# EAGLE design midicontrol_v6 (EAGLE 9.4.0)
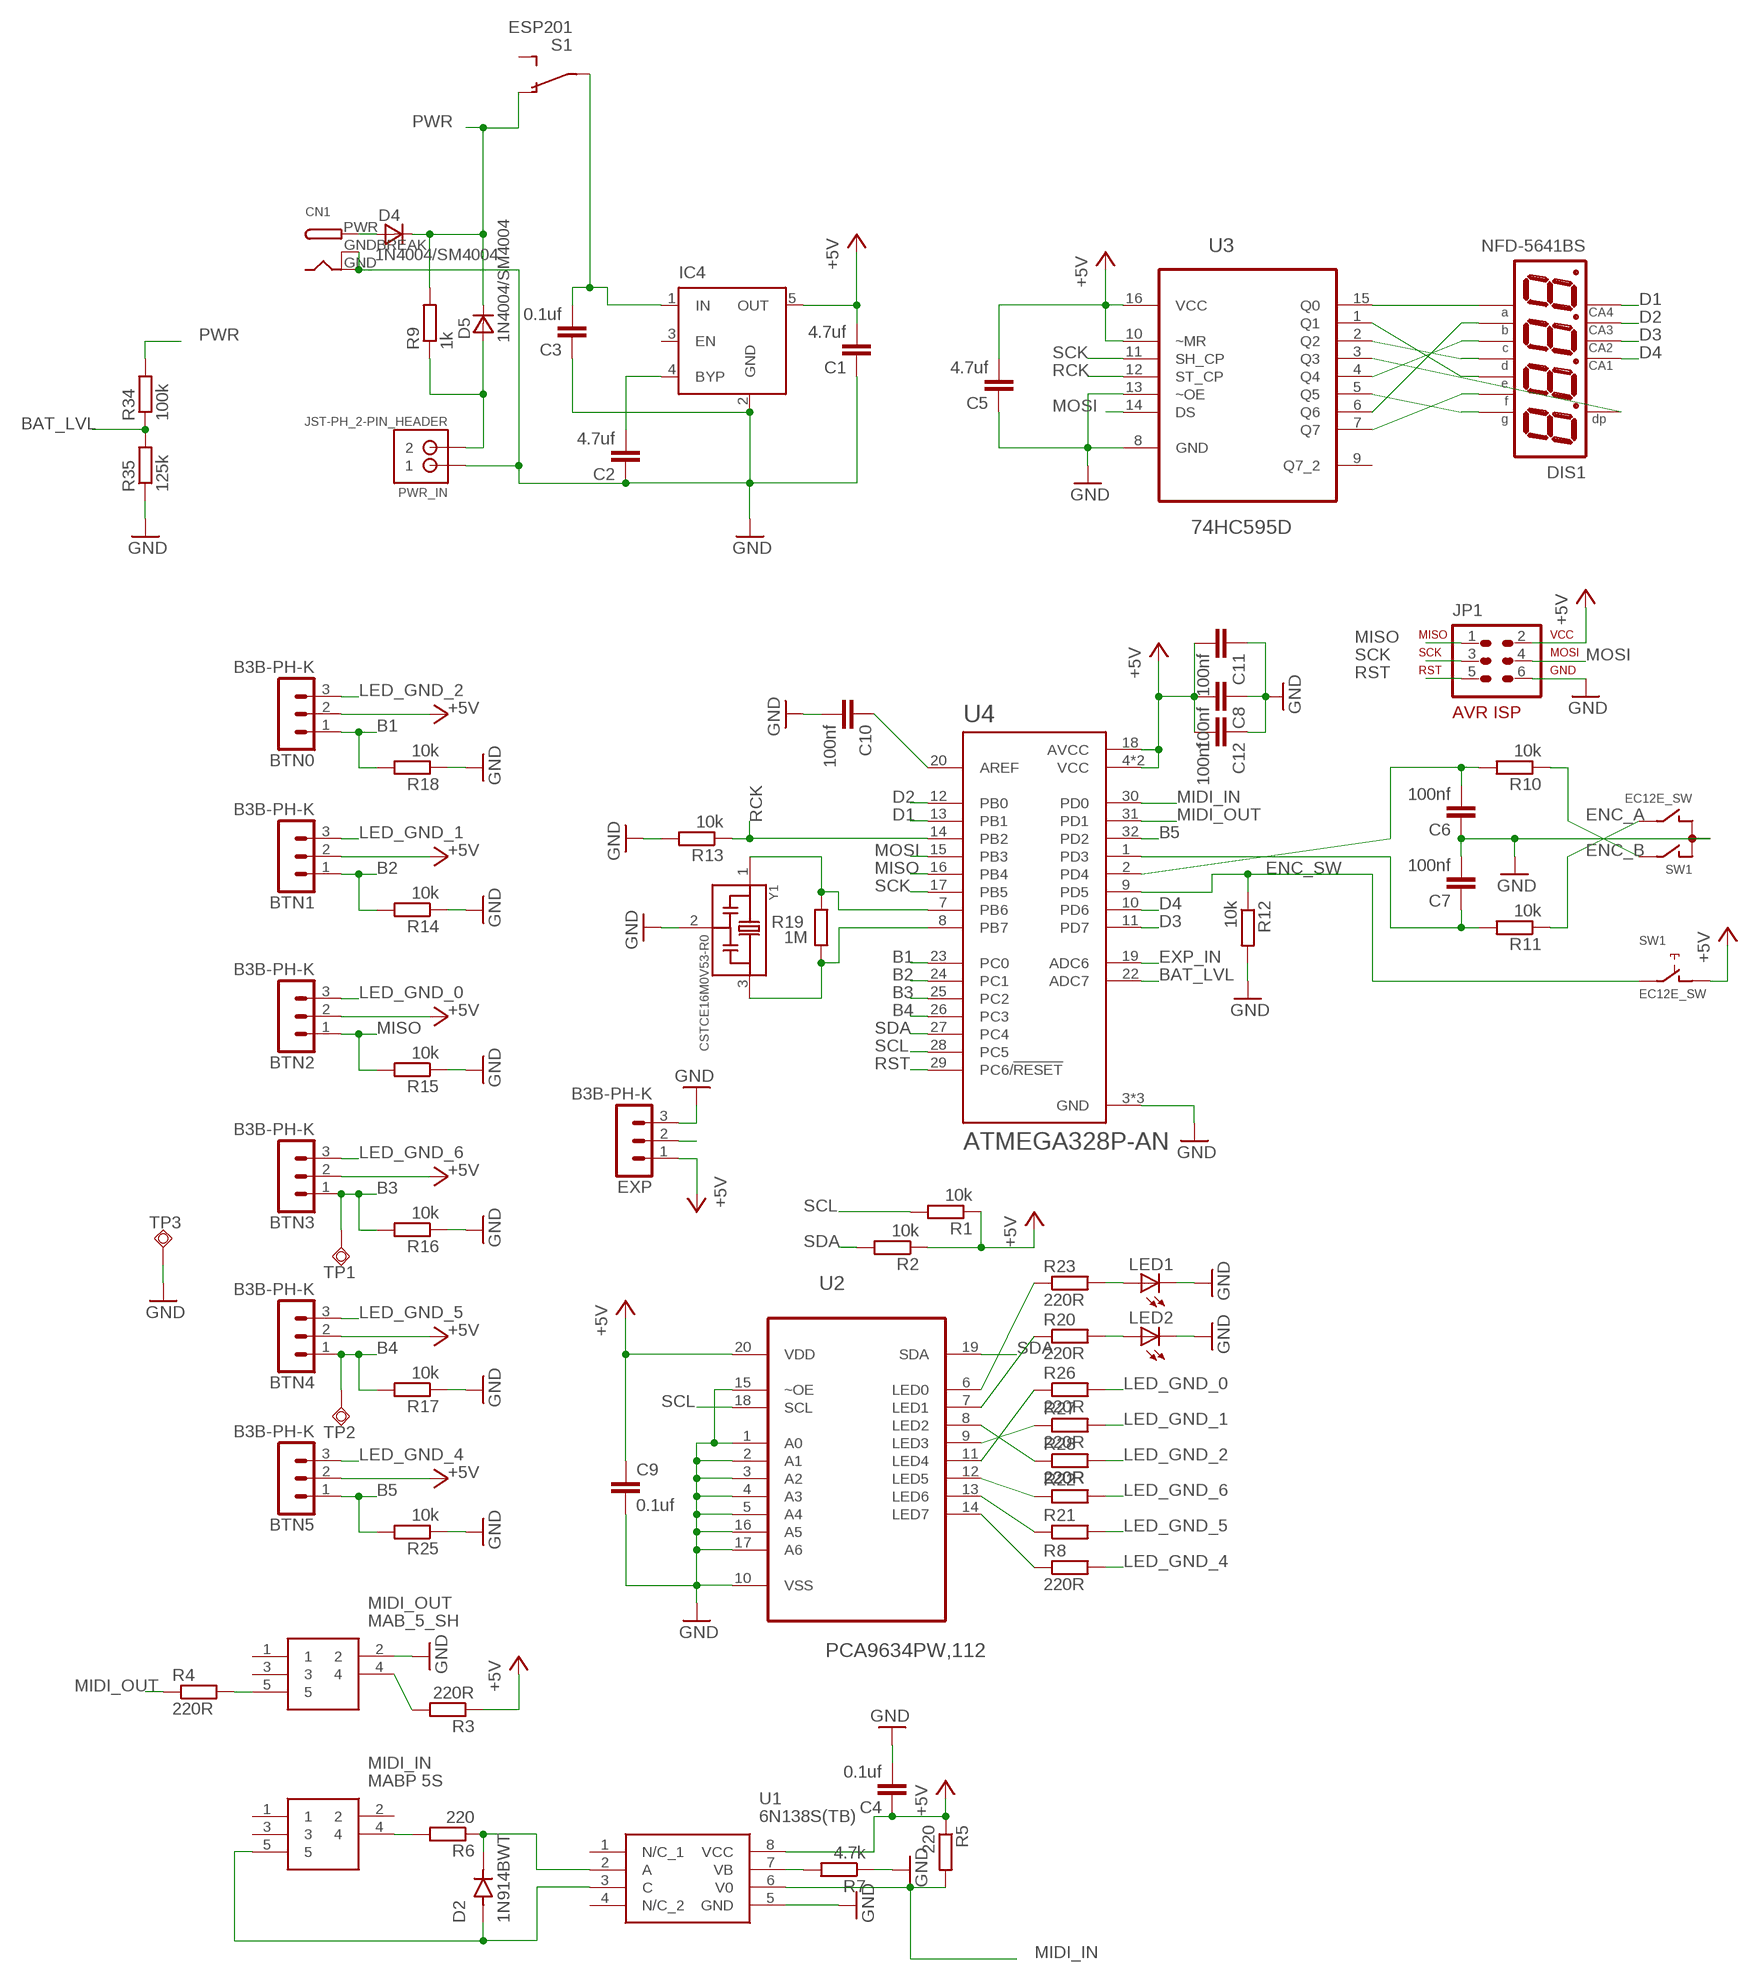
[diagram p0: schematic, sheet 1]

## Parts
BTN0  B3B-PH-K  [B3B-PH-K]
BTN1  B3B-PH-K  [B3B-PH-K]
BTN2  B3B-PH-K  [B3B-PH-K]
BTN3  B3B-PH-K  [B3B-PH-K]
BTN4  B3B-PH-K  [B3B-PH-K]
BTN5  B3B-PH-K  [B3B-PH-K]
C1  4.7uf  C-EUC1206  [C1206]
C2  4.7uf  C-EUC1206  [C1206]
C3  0.1uf  C-EUC0603  [C0603]
C4  0.1uf  C-EUC0603  [C0603]
C5  4.7uf  C-EUC0603  [C0603]
C6  100nf  C-EUC0603  [C0603]
C7  100nf  C-EUC0603  [C0603]
C8  100nf  C-EUC1206  [C1206]
C9  0.1uf  C-EUC0603  [C0603]
C10  100nf  C-EUC0603  [C0603]
C11  100nf  C-EUC0603  [C0603]
C12  100nf  C-EUC0603  [C0603]
CN1  DCBARRELPTH  [DCJACK_2MM_PTH]
D2  1N914BWT  [SODFL1608X70N]
D4  1N4004/SM4004  SM4004  [MELF-MLL41]
D5  1N4004/SM4004  SM4004  [MELF-MLL41]
DIS1  NFD-5641BS  [NFD-5641]
EXP  B3B-PH-K  [B3B-PH-K]
IC4  MIC5219XX  [SOT23-5]
JP1  AVR-ISP-6HORZ  [AVR-ISP-6R]
LED1  LED3MM  [LED3MM]
LED2  LED3MM  [LED3MM]
MIDI_IN  MABP 5S  MAB_5_SH  [MAB-5-SH]
MIDI_OUT  MAB_5_SH  [MAB-5-SH]
PWR_IN  JST-PH_2-PIN_HEADER  [JST_B2B-PH_HEADER]
R1  10k  R-EU_R0603  [R0603]
R2  10k  R-EU_R0603  [R0603]
R3  220R  R-EU_R0603  [R0603]
R4  220R  R-EU_R0603  [R0603]
R5  220  R-EU_R0603  [R0603]
R6  220  R-EU_R0603  [R0603]
R7  4.7k  R-EU_R0603  [R0603]
R8  220R  R-EU_R0603  [R0603]
R9  1k  R-EU_R0603  [R0603]
R10  10k  R-EU_R0603  [R0603]
R11  10k  R-EU_R0603  [R0603]
R12  10k  R-EU_R0603  [R0603]
R13  10k  R-EU_R0603  [R0603]
R14  10k  R-EU_R0603  [R0603]
R15  10k  R-EU_R0603  [R0603]
R16  10k  R-EU_R0603  [R0603]
R17  10k  R-EU_R0603  [R0603]
R18  10k  R-EU_R0603  [R0603]
R19  1M  R-EU_R0603  [R0603-ROUND]
R20  220R  R-EU_R0603  [R0603]
R21  220R  R-EU_R0603  [R0603]
R22  220R  R-EU_R0603  [R0603]
R23  220R  R-EU_R0603  [R0603]
R25  10k  R-EU_R0603  [R0603]
R26  220R  R-EU_R0603  [R0603]
R27  220R  R-EU_R0603  [R0603]
R28  220R  R-EU_R0603  [R0603]
R34  100k  R-EU_R0603  [R0603]
R35  125k  R-EU_R0603  [R0603]
S1  ESP201  [ESP201]
SW1  EC12E_SW  [ALPS_EC12E_SW]
TP1  TPSQTP18R  [TP18R]
TP2  TPSQTP18R  [TP18R]
TP3  TPSQTP18R  [TP18R]
U1  6N138S(TB)  [SOP254P1030X460-8N]
U2  PCA9634PW,112  [SOP65P640X110-20N]
U3  74HC595D  [SOIC127P600X175-16N]
U4  ATMEGA328P-AN  [QFP80P900X900X120-32N]
Y1  CSTCE16M0V53-R0  [OSC_CSTCE16M0V53-R0]

## Nets
+5V: BTN0.2 BTN1.2 BTN2.2 BTN3.2 BTN4.2 BTN5.2 C1.2 C4.1 C5.2 C8.2 C9.1 C11.2 C12.2 EXP.1 IC4.5(OUT) JP1.2 R1.1 R2.1 R3.1 R5.1 SW1.D U1.8(VCC) U2.20(VDD) U3.10(~MR) U3.16(VCC) U4.4(VCC) U4.6(VCC) U4.18(AVCC)
B1: BTN0.1 R18.2 U4.23(PC0)
B2: BTN1.1 R14.2 U4.24(PC1)
B3: BTN3.1 R16.2 TP1.TP U4.25(PC2)
B4: BTN4.1 R17.2 TP2.TP U4.26(PC3)
B5: BTN5.1 R25.2 U4.32(PD2)
BAT_LVL: R34.1 R35.2 U4.22(ADC7)
D1: DIS1.P$6 U4.13(PB1)
D2: DIS1.P$8 U4.12(PB0)
D3: DIS1.P$9 U4.11(PD7)
D4: DIS1.P$12 U4.10(PD6)
ENC_A: R10.1 SW1.A
ENC_B: R11.1 SW1.B
ENC_SW: R12.1 SW1.E U4.9(PD5)
EXP_IN: EXP.2 U4.19(ADC6)
GND: C1.1 C2.1 C3.1 C4.2 C5.1 C6.1 C7.2 C8.1 C9.2 C10.2 C11.1 C12.1 CN1.GND CN1.GNDBREAK EXP.3 IC4.2(GND) JP1.6 LED1.K(C) LED2.K(C) MIDI_OUT.2 PWR_IN.P1 R7.1 R12.2 R13.2 R14.1 R15.1 R16.1 R17.1 R18.1 R25.1 R35.1 SW1.C TP3.TP U1.5(GND) U2.1(A0) U2.2(A1) U2.3(A2) U2.4(A3) U2.5(A4) U2.10(VSS) U2.15(~OE) U2.16(A5) U2.17(A6) U3.8(GND) U3.13(~OE) U4.3(GND) U4.5(GND) U4.21(GND) Y1.2
LED_GND_0: BTN2.3 R26.2
LED_GND_1: BTN1.3 R27.2
LED_GND_2: BTN0.3 R28.2
LED_GND_4: BTN5.3 R8.2
LED_GND_5: BTN4.3 R21.2
LED_GND_6: BTN3.3 R22.2
MIDI_IN: R5.2 U1.6(V0) U4.30(PD0)
MIDI_OUT: R4.1 U4.31(PD1)
MISO: BTN2.1 JP1.1 R15.2 U4.16(PB4)
MOSI: JP1.4 U3.14(DS) U4.15(PB3)
N$1: DIS1.P$11 U3.15(Q0)
N$2: DIS1.P$7 U3.6(Q6)
N$3: DIS1.P$4 U3.4(Q4)
N$4: DIS1.P$2 U3.2(Q2)
N$5: DIS1.P$1 U3.1(Q1)
N$6: DIS1.P$10 U3.7(Q7)
N$7: DIS1.P$5 U3.5(Q5)
N$8: DIS1.P$3 U3.3(Q3)
N$9: MIDI_OUT.4 R3.2
N$10: MIDI_OUT.5 R4.2
N$11: D2.A MIDI_IN.5 U1.3(C)
N$12: D2.C(K) R6.1 U1.2(A)
N$13: MIDI_IN.4 R6.2
N$14: R7.2 U1.7(VB)
N$15: C6.2 R10.2 U4.2(PD4)
N$16: R19.1 U4.8(PB7) Y1.3
N$17: C7.1 R11.2 U4.1(PD3)
N$18: D5.A PWR_IN.P2 R9.1
N$19: R19.2 U4.7(PB6) Y1.1
N$20: C2.2 IC4.4(BYP)
N$21: C10.1 U4.20(AREF)
N$22: LED2.A R20.2
N$23: R8.1 U2.14(LED7)
N$24: R21.1 U2.13(LED6)
N$25: CN1.PWR D4.A
N$26: C3.2 IC4.1(IN) S1.P$1(P)
N$27: R22.1 U2.12(LED5)
N$28: R26.1 U2.11(LED4)
N$29: R27.1 U2.9(LED3)
N$30: R28.1 U2.8(LED2)
N$31: R20.1 U2.7(LED1)
N$32: R23.1 U2.6(LED0)
N$33: LED1.A R23.2
PWR: D4.C D5.C R9.2 R34.2 S1.P$3(O)
RCK: R13.1 U3.12(ST_CP) U4.14(PB2)
RST: JP1.5 U4.29(PC6/!RESET)
SCK: JP1.3 U3.11(SH_CP) U4.17(PB5)
SCL: R1.2 U2.18(SCL) U4.28(PC5)
SDA: R2.2 U2.19(SDA) U4.27(PC4)
Unconnected: IC4.3(EN) MIDI_IN.1 MIDI_IN.2 MIDI_IN.3 MIDI_OUT.1 MIDI_OUT.3 S1.P$2(S) SW1.GND1(G) SW1.GND2(G) U1.1(N/C_1) U1.4(N/C_2) U3.9(Q7_2)

## Library data of the parts
BTN0 BTN1-BTN5 EXP = con-jst-ph:B3B-PH-K: HEADER
C1-C12 = rcl:C-EU: CAPACITOR, European symbol; SPICEPREFIX: C
CN1 = adafruit:DCBARREL: 2.0mm DC Barrel Jack DCJACK_2MM_PTH - Through Hole Jack (4UConnector: 05537)
D2 = 1N914BWT:1N914BWT: 1N914B Series 75 V 300 mA Surface Mount Small Signal Diode - SOD-523F; AVAILABILITY: Unavailable; DESCRIPTION: 1N914B Series 75 V 300 mA Surface Mount Small Signal Diode - SOD-523F; MF: ON Semiconductor; MP: 1N914BWT; PACKAGE: SOD-523F ON Semiconductor; PRICE: None
D4 D5 = _mod_diode:SM400*: SM4001 .. SM4007 General Purpose Rectifier, 1 A SMD-Version of 1N4001 .. 1N4007 Case: MELF-MLL41 = DO 213 AB Author: Dipl.-Ing. FH Rainer Bayer HHN Hochschule Heilbronn, rainer.bayer@hs-heilbronn.de Ingenieurbüro ing-rb, mail@ing-rb.de
DIS1 = display-misc:NFD-5641BS: Four Digit 0.56" CA Seven-Segment LED Display Futurlec part number: 7FR5641BS Created by RobG
IC4 = v-reg-micrel:MIC5219XX: VOLTAGE REGULATOR; OC_FARNELL: unknown; OC_NEWARK: unknown
JP1 = avr-7:AVR-ISP-6: AVR ISP-6 Serial Programming Header
LED1 LED2 = adafruit:LED: LED OSRAM: - CHIPLED LG R971, LG N971, LY N971, LG Q971, LY Q971, LO R971, LY R971 LH N974, LH R974 LS Q976, LO Q976, LY Q976 LO Q996 - Hyper CHIPLED LW Q18S LB Q993, LB Q99A, LB R99A - SideLED LS A670, LO A670, LY A670, LG A670, LP A670 LB A673, LV A673, LT A673, LW A673 LH A674 LY A675 LS A676, LA A676, LO A676, LY A676, LW A676 LS A679, LY A679, LG A679 - Hyper Micro SIDELED® LS Y876, LA Y876, LO Y876, LY Y876 LT Y87S - SmartLED LW L88C, LW L88S LB L89C, LB L89S, LG L890 LS L89K, LO L89K, LY L89K LS L896, LA L896, LO L896, LY L896 - TOPLED LS T670, LO T670, LY T670, LG T670, LP T670 LSG T670, LSP T670, LSY T670, LOP T670, LYG T670 LG T671, LOG T671, LSG T671 LB T673, LV T673, LT T673, LW T673 LH T674 LS T676, LA T676, LO T676, LY T676, LB T676, LH T676, LSB T676, LW T676 LB T67C, LV T67C, LT T67C, LS T67K, LO T67K, LY T67K, LW E67C LS E67B, LA E67B, LO E67B, LY E67B, LB E67C, LV E67C, LT E67C LW T67C LS T679, LY T679, LG T679 LS T770, LO T770, LY T770, LG T770, LP T770 LB T773, LV T773, LT T773, LW T773 LH T774 LS E675, LA E675, LY E675, LS T675 LS T776, LA T776, LO T776, LY T776, LB T776 LHGB T686 LT T68C, LB T68C - Hyper Mini TOPLED® LB M676 - Mini TOPLED Santana® LG M470 LS M47K, LO M47K, LY M47K Source: http://www.osram.convergy.de/
MIDI_IN MIDI_OUT = MAB_5_SH:MAB_5_SH: HIRSCHMANN - MAB 5 SH - SOCKET, DIN, PCB, 5PIN Source: Datasheet <http://www.farnell.com/datasheets/1599432.pdf>; DESCRIPTION: HIRSCHMANN - MAB 5 SH - SOCKET, DIN, PCB, 5PIN; HEIGHT: mm; MANUFACTURER_NAME: Hirschmann; MANUFACTURER_PART_NUMBER: MAB 5 SH
PWR_IN = srg:JST-PH_2-PIN_HEADER: 2-pin JST PH Shrouded Header, top entry P/N B2B-PH-K-S Mating connector PHR-2 Mating cable assembly: Sparkfun PRT-09914 <http://www.sparkfun.com/products/9914>
R1-R18 R20-R23 R25-R28 R34 R35 = rcl:R-EU_: RESISTOR, European symbol; SPICEPREFIX: R
R19 = SmartPrj:R-EU_: RESISTOR, European symbol
S1 = olli:ESP201: Switch ESP201 available at reichelt.de
SW1 = switch-alps:EC12E_SW: ALPS rotary Encoder EC12E series with switch; MPN: EC12E2424407; OC_FARNELL: 1520813; OC_NEWARK: 74M1068
TP1-TP3 = testpad:TPSQ: Test pad
U1 = 6N138S(TB):6N138S(TB): High Speed Optocouplers Low Input, High Gain DC Input Source: Datasheet <https://componentsearchengine.com/Datasheets/1/6N138S(TB).pdf>; DESCRIPTION: High Speed Optocouplers Low Input, High Gain DC Input; HEIGHT: 4.6mm; MANUFACTURER_NAME: Everlight; MANUFACTURER_PART_NUMBER: 6N138S(TB); MOUSER_PART_NUMBER: 638-6N138STB; MOUSER_PRICE-STOCK: https://www.mouser.com/Search/Refine.aspx?Keyword=638-6N138STB
U2 = PCA9634PW_112:PCA9634PW,112: 8-bit Fm+ I2C-bus LED driver; AVAILABILITY: Unavailable; DESCRIPTION: LED DRVR 16Segment 2.5V/3.3V/5V 20-Pin TSSOP Tube; MF: NXP USA; MP: PCA9634PW,112; PACKAGE: TSSOP-20 NXP Semiconductors; PRICE: None
U3 = 74HC595D:74HC595D: 8-bit serial-in parallel-out shift register; AVAILABILITY: Unavailable; DESCRIPTION: Shift Register Single 8-Bit Serial to Serial/Parallel 16-Pin SO; MF: Toshiba Semiconductor; MP: 74HC595D; PACKAGE: SO-16 NXP Semiconductors; PRICE: None
U4 = ATMEGA328P-AN:ATMEGA328P-AN: ATmega Series 20 MHz 32 KB Flash 2 KB SRAM 8-Bit Microcontroller - TQFP-32; AVAILABILITY: Unavailable; DESCRIPTION: MCU 8-bit ATmega AVR RISC 32KB Flash 2.5V/3.3V/5V 32-Pin TQFP Tray; MF: Microchip; MP: ATMEGA328P-AN; PACKAGE: TQFP-32 Microchip; PRICE: None
Y1 = CSTCE16M0V53-R0:CSTCE16M0V53-R0: 16MHz Ceramic Resonator Built in Capacitor 15pF ±0.3% -20°C ~ 80°C Surface Mount; AVAILABILITY: Unavailable; DESCRIPTION: Ceramic Resonator 16MHz ??0.5% _Tol_ ??0.3% _Stability_ 15pF 40Ohm 3-Pin CSMD T/R; MF: Murata; MP: CSTCE16M0V53-R0; PACKAGE: SMD-3 Murata; PRICE: None

## Net classes
0 default: clearance 0.152 mm

## Board
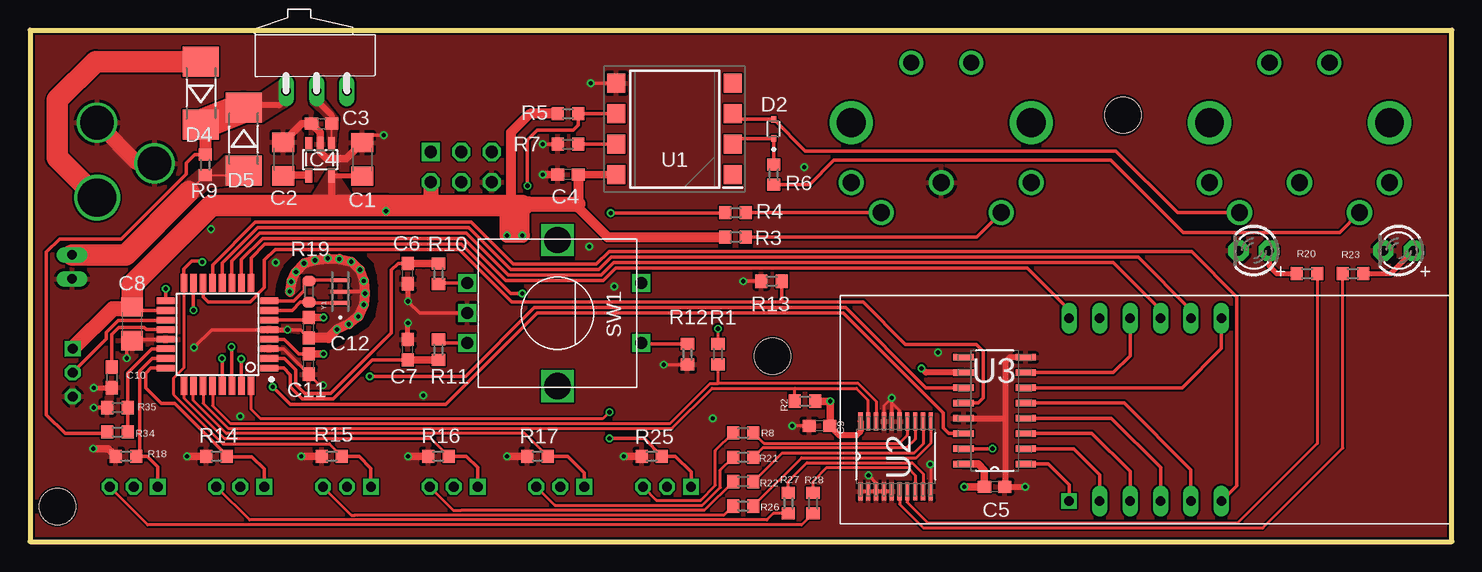
[diagram p1: board, top side]
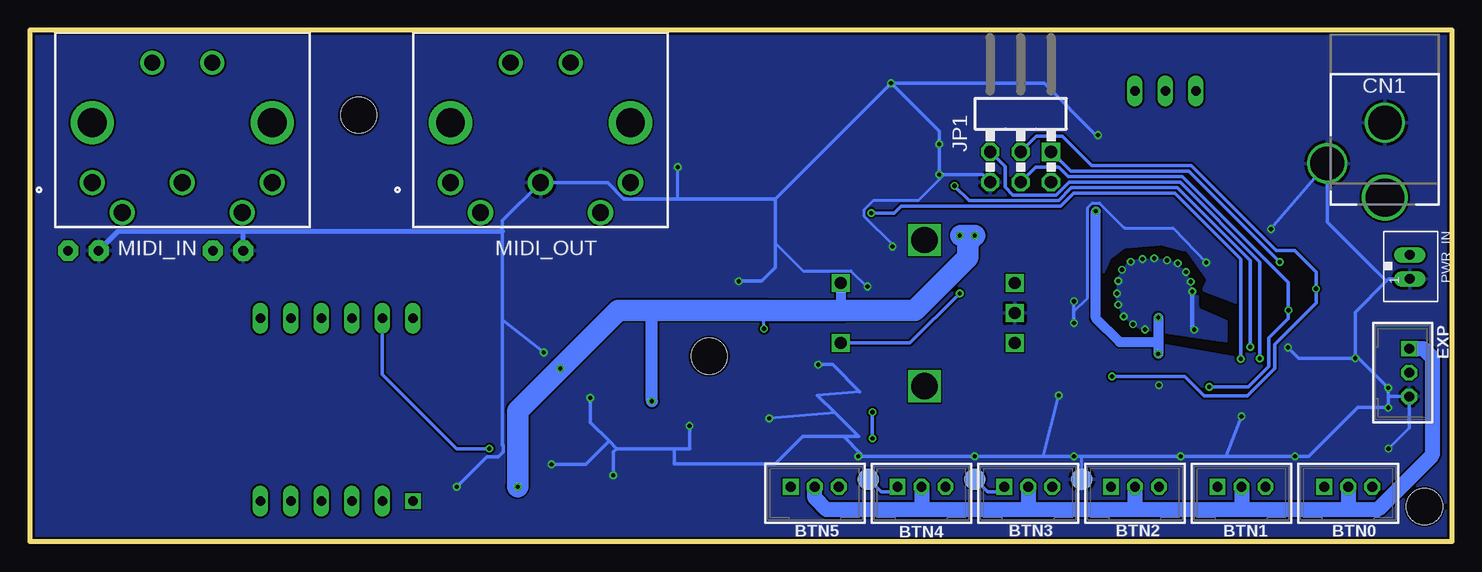
[diagram p2: board, bottom side, seen from below]

Size 118.49 x 42.67 mm. Coordinates in mm from the lower left corner, seen from the top.
Outline: 0,42.67 0,0 118.49,0 118.49,42.67 0,42.67
Copper layers (1*16): Top 0.035mm / dielectric 1.5mm / Bottom 0.035mm
Design rules "aisler_2_layer": minimum track width 0.1mm, minimum drill 0.2mm, track to track 0.1mm, track to pad 0.1mm, pad to pad 0.1mm, via to via 0.1mm, smd to smd 0.1mm, copper to edge 0.2mm, drill to drill 0.21mm, minimum pad ring 0.25mm, minimum via ring 0.15mm, stop-mask expansion 0mil, vias tented up to drill 0mil, thermal gap 10mil
Holes 3 mm at 91.08,35.56 61.87,15.47 2.29,2.92

### Footprints (pad centres in the part's own frame; a part is rotated, then mirrored left to right if it is on the bottom)
B3B-PH-K = drill 0.813 square: 1 -2,0 | drill 0.813 octagon: 2 0,0; 3 2,0
C1206 = smd 1.6 x 1.8: 1 -1.4,0; 2 1.4,0
C0603 = smd 1.1 x 1: 1 -0.85,0; 2 0.85,0
DCJACK_2MM_PTH = drill 2.8: GND 0,7.35; GNDBREAK 4.8,10.75 | drill 3.2: PWR 0,13.6
SODFL1608X70N = smd 0.53 x 0.4: A 0.8,0; C -0.8,0
MELF-MLL41 = smd 2.5 x 3: A 2.625,0; C -2.625,0
NFD-5641 = drill 0.8 square: P$1 -6.35,-7.62 | drill 0.8 long: P$2 -3.81,-7.62; P$3 -1.27,-7.62; P$4 1.27,-7.62; P$5 3.81,-7.62; P$6 6.35,-7.62; P$7 6.35,7.62; P$8 3.81,7.62; P$9 1.27,7.62; P$10 -1.27,7.62; P$11 -3.81,7.62; P$12 -6.35,7.62
SOT23-5 = smd 0.55 x 1.2: 1 -0.95,-1.3; 2 0,-1.3; 3 0.95,-1.3; 4 0.95,1.3; 5 -0.95,1.3
AVR-ISP-6R = drill 1.016 square: 1 -2.54,-1.27 | drill 1.016 octagon: 2 -2.54,1.27; 3 0,-1.27; 4 0,1.27; 5 2.54,-1.27; 6 2.54,1.27
LED3MM = drill 0.813 pad 1.676 octagon: A -1.27,0; K 1.27,0
MAB-5-SH = drill 1.4 pad 2.1: 1 7.5,-2.5; 2 0,-2.5; 3 -7.5,-2.5; 4 5,0; 5 -5,0 | drill 1.35 pad 2: 6 -2.5,-12.5; 7 2.5,-12.5 | drill 2.4 pad 3.6: 8 -7.5,-7.5; 9 7.5,-7.5
JST_B2B-PH_HEADER = drill 0.8 long: P1 1.075,0.048; P2 -0.925,0.048
R0603 = smd 1 x 1.1: 1 -0.85,0; 2 0.85,0
R0603-ROUND = smd 0.898 x 1.1: 1 -0.889,0; 2 0.889,0
ESP201 = drill 0.8 long: P$1 0,0; P$2 2.54,0; P$3 -2.54,0
ALPS_EC12E_SW = drill 1 square: A -2.5,-7.5; B 2.5,-7.5; C 0,-7.5; D -2.5,7; E 2.5,7 | drill 2.2 square: GND1 -6.1,0; GND2 6.1,0
TP18R = smd 1.8 x 1.8: TP 0,0
SOP254P1030X460-8N = smd 1.5 x 1.6: 1 -4.85,3.81; 2 -4.85,1.27; 3 -4.85,-1.27; 4 -4.85,-3.81; 5 4.85,-3.81; 6 4.85,-1.27; 7 4.85,1.27; 8 4.85,3.81
SOP65P640X110-20N = smd 1.473 x 0.356: 1 -2.921,2.921; 2 -2.921,2.286; 3 -2.921,1.626; 4 -2.921,0.965; 5 -2.921,0.33; 6 -2.921,-0.33; 7 -2.921,-0.965; 8 -2.921,-1.626; 9 -2.921,-2.286; 10 -2.921,-2.921; 11 2.921,-2.921; 12 2.921,-2.286; 13 2.921,-1.626; 14 2.921,-0.965; 15 2.921,-0.33; 16 2.921,0.33; 17 2.921,0.965; 18 2.921,1.626; 19 2.921,2.286; 20 2.921,2.921
SOIC127P600X175-16N = smd 1.702 x 0.533: 1 -2.591,4.445; 2 -2.591,3.175; 3 -2.591,1.905; 4 -2.591,0.635; 5 -2.591,-0.635; 6 -2.591,-1.905; 7 -2.591,-3.175; 8 -2.591,-4.445; 9 2.591,-4.445; 10 2.591,-3.175; 11 2.591,-1.905; 12 2.591,-0.635; 13 2.591,0.635; 14 2.591,1.905; 15 2.591,3.175; 16 2.591,4.445
QFP80P900X900X120-32N = smd 1.5 x 0.55: 1 -4.3,2.8; 2 -4.3,2; 3 -4.3,1.2; 4 -4.3,0.4; 5 -4.3,-0.4; 6 -4.3,-1.2; 7 -4.3,-2; 8 -4.3,-2.8; 17 4.3,-2.8; 18 4.3,-2; 19 4.3,-1.2; 20 4.3,-0.4; 21 4.3,0.4; 22 4.3,1.2; 23 4.3,2; 24 4.3,2.8 | smd 0.55 x 1.5: 9 -2.8,-4.3; 10 -2,-4.3; 11 -1.2,-4.3; 12 -0.4,-4.3; 13 0.4,-4.3; 14 1.2,-4.3; 15 2,-4.3; 16 2.8,-4.3; 25 2.8,4.3; 26 2,4.3; 27 1.2,4.3; 28 0.4,4.3; 29 -0.4,4.3; 30 -1.2,4.3; 31 -2,4.3; 32 -2.8,4.3
OSC_CSTCE16M0V53-R0 = smd 0.3 x 1.6: 1 -0.95,0; 2 0,0; 3 0.95,0

### Placement (x,y rotation side)
BTN0  8.64,4.57 0 bottom
BTN1  17.53,4.57 0 bottom
BTN2  26.42,4.57 0 bottom
BTN3  35.31,4.57 0 bottom
BTN4  44.2,4.57 0 bottom
BTN5  53.09,4.57 0 bottom
C1  27.69,31.88 270 top
C2  21.11,31.9 270 top
C3  24.31,34.85 0 top
C4  44.83,30.61 180 top
C5  80.39,4.57 180 top
C6  31.5,22.35 90 top
C7  31.5,16 90 top
C8  8.51,18.16 90 top
C9  65.79,9.65 180 top
C10  6.81,13.69 270 top
C11  23.24,14.81 90 top
C12  23.24,17.83 90 top
CN1  5.59,42.29 180 bottom
D2  61.98,34.42 90 top
D4  14.25,37.41 90 top
D5  17.81,33.58 270 top
DIS1  92.94,11 0 top
EXP  3.56,14.1 270 bottom
IC4  24.18,31.85 180 top
JP1  35.94,31.24 180 bottom
LED1  114.05,24.26 180 top
LED2  101.98,24.26 180 top
MIDI_IN  105.79,27.43 180 bottom
MIDI_OUT  75.95,27.43 180 bottom
PWR_IN  3.56,22.99 270 bottom
R1  57.33,15.65 270 top
R2  64.59,11.71 180 top
R3  58.8,25.4 0 top
R4  58.8,27.43 0 top
R5  44.83,35.69 0 top
R6  61.98,30.61 270 top
R7  44.83,33.15 0 top
R8  59.44,9.07 180 top
R9  14.61,31.42 90 top
R10  34.04,22.35 90 top
R11  34.04,16 270 top
R12  54.79,15.62 270 top
R13  61.8,21.72 180 top
R14  15.54,7.11 0 top
R15  25.15,7.11 0 top
R16  34.04,7.11 0 top
R17  42.29,7.11 0 top
R18  8,7.11 0 top
R19  23.24,20.85 270 top
R20  106.43,22.35 180 top
R21  59.44,7.04 180 top
R22  59.44,5 180 top
R23  110.24,22.35 0 top
R25  51.82,7.11 0 top
R26  59.44,2.97 180 top
R27  63.2,3.2 270 top
R28  65.25,3.2 270 top
R34  7.29,9.14 180 top
R35  7.29,11.18 0 top
S1  23.88,37.59 0 top
SW1  43.94,19.05 270 top
TP1  39.75,5.21 0 bottom
TP2  48.64,5.21 0 bottom
TP3  30.86,5.21 0 bottom
U1  53.72,34.42 180 top
U2  72.14,7.11 90 top
U3  80.39,10.92 180 top
U4  15.62,17.27 180 top
Y1  25.86,20.85 90 top

### Tracks (layer width: path | path; a pad name or v marks a point on that pad's centre or on a via)
+5V  (via drill 0.35)
  Top 0.254: v57.33,17.75 R1.1
  Top 0.305: 19.98,18.53 U4.6 23.03,18.47 C12.2 | C11.2 22.4,15.66 21.19,16.87 U4.4 | C8.2 8.77,19.27 U4.18
  Top 0.356: U2.20 69.22,10.2
  Top 0.406: C1.2 25.2,30.48 IC4.5
  Top 0.508: C8.2 8.51,21.42 | U3.10 74.65,14.1 v74.3,14.45 | C9.1 67.45,8.84 68.86,8.84 69.22,9.19 U2.20
  Top 0.61: 48.66,30.82 U1.8 C4.1 | R3.1 | U3.16 79.02,6.48 79.54,5.95 C5.2 v77.85,4.57 | C12.2 v24.46,18.68 | C11.2 v24.46,15.66 | IC4.5 25.13,28.06 | 25.13,28.06 25.13,28.03 | 25.13,28.06 25.15,28.04 | C9.1 66.68,9.69 v66.68,11.72 66.66,11.71 R2.1
  Top 0.813: 40.08,27.64 40.08,28.04 40.08,34.11 41.66,35.69 R5.1 | R3.1 48.13,25.4 45.68,27.85 45.68,28.16 C4.1 | v29.67,27.56 29.67,27.99 29.72,28.04
  Top 1.27: C8.2 8.37,19.42 6.88,19.42 EXP.1 | 45.68,28.16 41.54,28.16 41.02,27.64 | 40.08,27.64 39.75,27.3 v39.75,25.53 v41.02,25.53 41.02,27.64 | 41.02,27.64 41.02,28.04 | JP1.2 33.4,28.04
  Top 1.778: 41.02,28.04 40.08,28.04 33.4,28.04 29.72,28.04 25.15,28.04 | 8.51,19.65 8.51,21.42 15.12,28.03 25.14,28.03 25.15,28.04 | 24.51,28.04 25.15,28.04
  Bottom 0.254: v57.33,17.75 57.33,19.15 57.2,19.28
  Bottom 0.813: v24.46,18.68 24.46,16.64 | 24.46,16.64 v24.46,15.66 | 24.46,16.64 27.69,16.64 29.67,18.62 v29.67,27.56 | SW1.D 50.94,19.67 50.55,19.28
  Bottom 1.016: v66.68,11.72 66.68,19.1 66.5,19.28
  Bottom 1.27: BTN5.2 53.09,3.63 52.12,2.67 44.2,2.67 | EXP.1 2.38,16.1 1.65,15.37 1.65,7.21 6.19,2.67 8.64,2.67 | 8.64,2.67 17.53,2.67 | 17.53,2.67 26.42,2.67 | 26.42,2.67 35.31,2.67 | 35.31,2.67 44.2,2.67 | BTN4.2 44.2,2.67 | BTN3.2 35.31,2.67 | BTN2.2 26.42,2.67 | BTN1.2 17.53,2.67 | BTN0.2 8.64,2.67
  Bottom 1.778: 40.91,25.53 v39.75,25.53 40.36,24.92 40.36,23.69 44.77,19.28 50.55,19.28 57.2,19.28 66.5,19.28 69.47,19.28 v74.3,14.45 74.32,14.45 77.85,10.92 v77.85,4.57
  pour Top (no thermals): 24.89,31.11 23.24,28.45 27.05,28.58 25.4,31.11
B1
  Top 0.305: U4.23 10.2,15.27 9.15,14.22 9.15,7.11 R18.2 9.77,7.11 10.64,6.25 BTN0.1
  Top 0.61: R18.2 8.87,7.1
B2
  Top 0.305: U4.24 10.08,14.47 9.64,14.03 9.64,12.8 10.93,11.51 12.08,11.51 16.49,7.1 | R14.2 16.42,7.09 18.49,7.09 19.53,6.05 BTN1.1
  Top 0.61: 16.49,7.1 16.41,7.1 R14.2
B3
  Top 0.254: U4.25 12.81,12 16.25,8.56 33.44,8.56 R16.2
  Top 0.305: R16.2 36.37,7.11 37.31,6.18 BTN3.1
  Top 0.61: R16.2 34.9,7.1
  Bottom 0.305: BTN3.1 37.74,4.14 38.68,4.14 TP1.TP
B4
  Top 0.254: R17.2 41.24,9.02 16.37,9.02 13.62,11.76 U4.26
  Top 0.305: R17.2 44.83,7.11 46.2,5.75 BTN4.1
  Top 0.61: R17.2 43.16,7.1
  Bottom 0.305: BTN4.1 46.63,4.14 47.57,4.14 TP2.TP
B5  (via drill 0.35)
  Top 0.254: U4.32 18.42,11.04 19.23,10.24 47.73,10.24 v48.28,10.8
  Top 0.305: v48.28,8.61 51.17,8.61 R25.2 53.77,7.11 55.09,5.8 BTN5.1
  Top 0.61: R25.2 52.68,7.1
  Bottom 0.254: v48.28,10.8 v48.29,10.79
  Bottom 0.305: v48.28,8.61 v48.28,10.8
BAT_LVL
  Top 0.305: U4.22 10.15,16.07 8.14,14.06 R35.2 R34.1
D1
  Top 0.305: U4.13 15.21,21.58 15.21,23.07 18.78,26.64 36.78,26.64 40.28,23.14 47.2,23.14 48.25,24.19 96.8,24.19 100.56,20.42 100.56,4.65 DIS1.P$6
D2
  Top 0.305: U4.12 16.02,23.23 18.97,26.19 36.56,26.19 40.07,22.68 47.39,22.68 48.44,23.73 92.35,23.73 96.75,19.33 DIS1.P$8
D3
  Top 0.305: U4.11 16.82,23.39 19.16,25.73 36.35,25.73 39.85,22.22 47.58,22.22 48.63,23.27 90.27,23.27 94.21,19.33 DIS1.P$9
D4
  Top 0.305: U4.10 17.62,23.52 19.38,25.27 36.14,25.27 39.65,21.77 47.77,21.77 48.81,22.81 83.11,22.81 86.59,19.33 DIS1.P$12
ENC_A
  Top 0.305: 34.21,21.68 R10.1 34.08,21.55 SW1.A
ENC_B
  Top 0.305: SW1.B 34.34,16.55 R11.1
ENC_SW  (via drill 0.35)
  Top 0.305: U4.9 18.42,23.67 19.57,24.82 35.94,24.82 40.06,20.7 v41.02,20.7 | SW1.E 51.02,16.47 R12.1
  Bottom 0.305: SW1.E 45.17,16.55 v41.02,20.7
EXP_IN
  Top 0.305: U4.19 11.3,18.46 7.36,18.46 6.35,17.45 6.35,16.89 EXP.2
GND  (via drill 0.35)
  Top 0.254: U4.5 | C11.1 24.16,13.04 v24.41,13.04 | U2.17 71.17,11.35 v71.81,11.99 71.81,11.58 72.47,10.92 U2.15 | v52.81,14.76 52.82,14.77 R12.2 | v75.03,6.45 75.06,6.43 U2.10 | C9.2 64.92,9.64 v63.52,9.64
  Top 0.305: U4.3 21.14,16.07 C11.1 | U4.21 8.95,16.87 C8.1 8.05,16.3 v8.05,15.29 | R7.1 v42.72,33.15 | U1.5 v46.74,38.23 | C12.1 22.55,17.67 U4.5 | R35.1 v5.31,11.18 | C1.1 28.32,33.91 v29.49,33.91 | v21.46,17.67 15.13,17.67 v13.66,16.2 | R13.2 v59.44,21.72 | v27.91,20.7 27.76,20.85 Y1.2 | SW1.C 32.49,19.05 v31.5,20.04 | v71.81,11.99 U2.16 | U2.5 U2.4 U2.3 | U2.3 U2.2 U2.1 | U2.3 70.51,4.88 v69.88,5.52
  Top 0.406: C10.2 6.79,12.83 v5.31,12.83 | C6.1 v31.5,20.04 | C7.2 v31.5,18.24 | U4.5 v21.46,17.67
  Top 0.508: U3.8 81.66,15.37 81.26,14.96 81.26,10.29 | 81.26,10.29 81.26,4.59 C5.1 v82.93,4.57 | U3.13 81.26,10.29
  Top 0.61: R14.1 v13.08,7.11 | R15.1 v22.61,7.11 | R16.1 v31.5,7.11 | R17.1 v39.75,7.11 | R18.1 6.52,7.75 v5.28,7.75 | R25.1 v49.48,7.11 | C4.2 v42.72,30.61 | C2.1 22.65,34.85 C3.1 24.18,34.13 IC4.2 24.18,32.48 24.72,31.94 26.35,31.94 C1.1
  Top 0.813: v21.65,20.85 21.77,21.59 v21.77,21.67 v22.16,22.49 v22.84,23.22 v23.75,23.47 v24.82,23.62 v25.78,23.57 v26.77,23.34 v27.5,22.67 v27.81,21.74 v27.91,20.7 v27.81,19.76 v27.36,18.77 v26.57,18.14 v25.58,17.7 24.85,16.98 C12.1
  Top 1.27: CN1.GND 8.99,31.54 CN1.GNDBREAK
  Bottom 0.254: v5.28,7.75 3.56,9.47 | CN1.GNDBREAK v15.08,26.07 | 34.04,7.11 v32.77,12.19 | 49.36,12.5 52.87,12.21 | 51.41,10.74 v56.9,10.29 | 18.8,7.11 v17.53,10.43 | 79.12,18.47 v75.67,15.77 | 64.52,28.58 v64.52,31.24 | 56.39,24.89 54.07,22.58 50.08,22.58 48.78,21.28 v48.69,21.28 | 42.29,30.61 44.48,28.42 48.23,28.42 48.99,27.66 48.99,27.16 46.61,24.77 v46.61,24.61 | TP3.TP 30.86,7.11 | 31.5,19.18 30.35,20.32 30.35,27.84 29.95,28.25 29.38,28.25 27.3,26.16 23.24,26.16 v20.47,23.27
  Bottom 0.305: JP1.6 39.12,30.61 42.29,30.61 v42.72,30.61 v42.72,33.15 42.72,34.21 v46.74,38.23 | v46.74,38.23 33.98,38.23 29.67,33.91 v29.49,33.91 29.44,33.86 | 10.85,32.01 CN1.GNDBREAK 10.39,26.64 5.46,21.72 | PWR_IN.P1 5.27,21.91 5.46,21.72 | 5.46,21.72 8.05,19.13 8.05,15.37 | 8.05,15.37 v8.05,15.29 12.75,15.29 v13.66,16.2 | 5.31,12.19 v5.31,11.18 7.85,11.18 11.91,7.11 v13.08,7.11 18.8,7.11 v22.61,7.11 30.86,7.11 v31.5,7.11 34.04,7.11 v39.75,7.11 v49.48,7.11 49.26,7.33 50.7,8.77 | 5.31,12.19 v5.31,12.83 7.85,15.37 8.05,15.37 | 50.7,8.77 49.43,8.77 51.41,10.74 52.87,12.21 | 50.7,8.77 54.1,8.77 56.39,6.48 64.82,6.48 64.82,7.75 | 64.82,7.75 63.52,7.75 v63.52,9.64 | 64.82,7.75 69.6,7.75 | v82.93,4.57 80.44,7.06 79.47,7.06 79.07,7.46 79.07,8.03 79.12,8.08 79.12,18.47 79.12,25.88 79.12,26.76 MIDI_OUT.2 70.36,29.93 69.01,28.58 64.52,28.58 56.39,28.58 | 56.39,28.58 v46.74,38.23 | v31.5,18.24 31.5,19.18 v31.5,20.04 | 56.39,28.58 56.39,24.89 56.39,22.86 57.53,21.72 v59.44,21.72 | v52.81,14.76 51.61,14.76 49.36,12.5 | v69.88,5.52 69.88,7.47 69.6,7.75 | v71.81,11.99 71.81,9.96 70.23,8.38 | 70.23,8.38 69.6,7.75 | 5.31,12.19 5.21,12.1 EXP.3 3.56,9.47 | v75.03,6.45 72.16,6.45 70.23,8.38
  Bottom 0.356: v21.65,20.85 21.65,17.86 v21.46,17.67
  Bottom 0.406: LED1.K 111.15,25.88 100.71,25.88 | 100.71,25.88 79.12,25.88 | LED2.K 100.71,25.88
  pour Bottom (rank 3): -6.6,46.48 -6.6,-10.67 139.45,-10.67 139.45,47.75 -5.33,47.75
  cutout Top: 21.34,20.45 21.46,21.21 22.35,22.61 23.24,23.37 25.02,23.62 27.05,23.11 27.81,21.97 27.81,20.32 27.56,19.18 26.8,18.29 25.53,17.65 24.26,16.89 22.73,17.02 20.07,17.4 20.07,16.76 23.62,16.26 24.26,16.13 25.27,16.26 26.03,16.64 26.42,17.14 27.3,17.53 28.07,18.03 28.58,18.8 28.83,20.07 28.83,21.34 28.7,22.22 28.45,23.11 27.81,23.75 26.8,24.38 25.4,24.51 23.62,24.51 22.48,24.13 21.84,23.5 21.34,22.99 21.08,22.48 20.7,21.34 20.57,20.32 21.34,20.32
  pour Top (rank 3): -2.79,45.85 -2.79,-4.32 126.11,-4.32 126.11,45.85
  cutout Bottom: 21.2,20.75 21.9,22.61 23.45,23.77 26.21,23.77 27.24,23.43 28.12,22.03 28.26,20.29 27.73,18.69 26.18,17.59 25.5,17.4 18.55,16.41 18.47,16.39 18.47,18.57 20.83,19.6 20.83,20.7 17.42,19.41 17.42,15.54 25.27,16.89 26.42,17.02 27.56,17.53 28.58,19.05 28.83,20.45 28.83,21.97 28.19,23.5 27.18,24.26 25.78,24.38 24.26,24.51 22.23,24 20.7,21.84
LED_GND_0
  Top 0.254: R26.2 57.82,2.21 27.05,2.21 26.78,2.21 BTN2.3
LED_GND_1
  Top 0.254: R27.2 61.95,2.35 61.4,1.8 18.3,1.8 BTN1.3
LED_GND_2
  Top 0.254: R28.2 64.3,1.4 9.81,1.4 BTN0.3
LED_GND_4
  Top 0.254: R8.2 57.12,7.61 57.12,4.69 55.89,3.45 52.2,3.45 BTN5.3
LED_GND_5
  Top 0.254: R21.2 57.53,5.98 57.53,4.52 56.03,3.03 43.74,3.03 BTN4.3
LED_GND_6
  Top 0.254: R22.2 56.2,2.62 35.94,2.62 35.26,2.62 BTN3.3
MIDI_IN  (via drill 0.35)
  Top 0.305: U1.6 R5.2 45.68,34.72 45.27,34.31 42.27,34.31 41.45,33.5 v41.45,29.67 | v16.8,16.23 16.8,13 U4.30
  Bottom 0.305: v16.8,16.23 16.8,23.43 22.88,29.52 31.7,29.52 32.77,28.45 40.23,28.45 v41.45,29.67
MIDI_OUT  (via drill 0.35)
  Top 0.305: U4.31 17.6,12.99 v17.6,15.24 | R4.1 57.93,27.41 v48.39,27.41
  Bottom 0.305: v17.6,15.24 17.6,23.57 23.09,29.06 31.51,29.06 32.58,27.99 45.9,27.99 46.48,27.41 v48.39,27.41
MISO  (via drill 0.35)
  Top 0.254: R15.2 24.95,8.15 16.08,8.15 11.94,12.3 11.94,13.61 12.82,14.5 U4.16
  Top 0.305: v14.35,23.32 14.25,23.42 13.49,23.42 12.82,22.75 U4.16 | R15.2 27.43,7.11 28.42,6.13 BTN2.1
  Top 0.61: R15.2 26.01,7.1
  Bottom 0.305: JP1.1 31.77,30.89 21.92,30.89 v14.35,23.32
MOSI  (via drill 0.35)
  Top 0.305: U4.15 v13.62,19.3 | v20.22,12.9 21.69,11.43 34.63,11.43 42.25,19.05 67.78,19.05 76.11,10.72 76.11,9.49 76.58,9.02 U3.14
  Bottom 0.305: 35.38,30.53 JP1.4 34.67,31.24 32.78,31.24 31.97,30.43 22.45,30.43 13.62,21.6 v13.62,19.3 13.62,18.59 15.25,16.97 15.25,14.62 16.97,12.9 v20.22,12.9
N$1  (via drill 0.35)
  Top 0.305: U3.15 v80.21,7.75
  Bottom 0.305: v80.21,7.75 82.93,7.75 89.13,13.94 DIS1.P$11
N$2
  Top 0.305: DIS1.P$7 99.29,16.1 96.01,12.83 U3.6
N$3
  Top 0.305: U3.4 90.12,10.29 94.21,6.2 DIS1.P$4
N$4
  Top 0.305: U3.2 86.97,7.75 89.13,5.59 DIS1.P$2
N$5
  Top 0.305: U3.1 84.84,6.48 86.59,4.72 DIS1.P$1
N$6
  Top 0.305: DIS1.P$10 91.67,15.49 90.27,14.1 U3.7
N$7
  Top 0.305: U3.5 91.19,11.56 96.75,5.99 DIS1.P$5
N$8
  Top 0.305: U3.3 88.49,9.02 91.67,5.84 DIS1.P$3
N$9
  Top 0.305: MIDI_OUT.4 78.91,25.4 R3.2
N$10
  Top 0.305: MIDI_OUT.5 R4.2
N$11
  Top 0.305: U1.3 59.04,35.22 D2.A 64.61,32.59 90.48,32.59 95.63,27.43 MIDI_IN.5
N$12
  Top 0.305: U1.2 59.04,33.62 D2.C R6.1
N$13
  Top 0.305: R6.2 62.01,29.79 64.97,29.79 66.98,31.8 90.07,31.8 96.09,25.78 109.14,25.78 MIDI_IN.4
N$14
  Top 0.305: R7.2 U1.7
N$15
  Top 0.305: C6.2 30.67,23.2 30.12,22.66 30.12,17.41 25.06,12.34 22.91,12.34 22.15,13.11 22.15,14.33 21.2,15.27 U4.2
  Top 0.61: R10.2 32.86,23.2 32.79,23.18 32.77,23.2 C6.2
N$16
  Top 0.305: Y1.3 23.3,21.8 R19.1 22.86,21.74 22.86,20.95 21.98,20.07 U4.8
N$17
  Top 0.305: U4.1 21.14,14.47 21.69,13.92 21.69,12.9 22.71,11.89 25.27,11.89 28.54,15.15 C7.1
  Top 0.61: R11.2 C7.1
N$18
  Top 0.152: 13.23,29.19 R9.1 16.6,30.57 D5.A
  Top 1.778: PWR_IN.P2 7.96,23.91 13.23,29.19
  pour Top (no thermals): 12.62,29.79 14.07,31.01 15.16,31.06 16.31,32.18 17.22,30.78 16.36,29.69 14.96,29.51 13.84,28.63
N$19
  Top 0.305: Y1.1 23.3,19.9 R19.2 22.53,19.96 21.84,19.27 U4.7
N$20
  Top 0.61: IC4.4 21.16,30.55 C2.2
  Top 0.813: 21.26,30.35 C2.2
N$21
  Top 0.305: U4.20 11.3,17.7 9.7,17.7 9.54,17.87 7.42,17.87 6.81,17.26 C10.1
N$22
  Top 0.406: R20.2 103.89,22.35 103.25,22.99 LED2.A
N$23
  Top 0.254: R8.1 61.15,8.2 72.44,8.2 73.1,8.86 U2.14
N$24
  Top 0.254: R21.1 61.05,7.8 73.03,7.8 73.76,8.53 U2.13
N$25
  Top 1.778: CN1.PWR 2.27,32.01 2.27,33.14 2.28,36.84 5.47,40.04 D4.A
N$26
  Top 0.152: IC4.1 25.13,34.83
  Top 0.508: S1.P$1 23.88,36.8 25.13,35.55 25.13,34.83
  Top 0.813: C3.2 25.13,34.83
  pour Top (no thermals): 24.64,35.31 23.37,36.58 24.26,37.08 25.65,35.31 25.4,32.64 24.89,32.64 24.77,34.42
N$27
  Top 0.254: R22.1 62.67,7.39 73.68,7.39 74.42,8.14 U2.12
N$28
  Top 0.254: R26.1 64.3,6.98 73.86,6.98 75.06,8.18 U2.11
N$29
  Top 0.254: R27.1 63.2,5.04 64.73,6.58 73.51,6.58 74.42,5.66 U2.9
N$30
  Top 0.254: U2.8 73.76,5.54 73.13,6.17 66.41,6.17 65.25,5.02 R28.1
N$31
  Top 0.254: R20.1 107.29,22.34 107.29,8.18 100.66,1.55 74.83,1.55 73.1,3.28 U2.7
N$32
  Top 0.254: R23.1 109.4,22.34 109.4,7.81 102.73,1.14 74.45,1.14 72.47,3.12 U2.6
N$33
  Top 0.406: LED1.A 113.41,22.35 R23.2
PWR
  Top 0.305: R34.2 6.31,9.02 2.92,9.02 1.37,10.57 1.37,24.16 2.46,25.25 7.61,25.25 13.02,30.66 13.02,31.58 13.72,32.27 R9.2
  Top 0.508: S1.P$3 21.34,36.96 20.76,36.38 17.98,36.38 D5.C
  Top 1.016: D4.C 14.61,34.43 R9.2
  Top 2.54: D4.C D5.C
  pour Top (no thermals): 19.3,34.98 21.44,36.32 20.83,38.46 19.25,37.39 18.97,35.33 19.28,34.98
RCK
  Top 0.305: U4.14 14.42,20.4 14.83,19.99 18.35,19.99 19.53,21.18 19.53,23.47 20.42,24.36 35.75,24.36 40.15,19.96 62.61,19.96 | 62.61,19.96 69.44,19.96 72.95,16.46 78.84,16.46 79.45,15.85 79.45,11.99 79.02,11.56 U3.12 | R13.1 62.65,20 62.61,19.96
RST  (via drill 0.35)
  Top 0.305: v16,15.27 16.02,15.25 U4.29
  Bottom 0.305: JP1.5 37.24,31.27 37.24,29.57 36.58,28.91 32.96,28.91 31.89,29.97 22.66,29.97 16,23.32 v16,15.27
SCK  (via drill 0.35)
  Top 0.305: U4.17 v11.32,21.08 | v28.32,13.77 36.3,13.77 42.04,19.51 67.97,19.51 74.65,12.83 U3.11
  Bottom 0.305: v28.32,13.77 22.25,13.77 20.65,12.17 17.04,12.17 14.78,14.44 14.78,16.43 11.32,19.89 v11.32,21.08 11.32,22.5 13.08,24.26 14.64,24.26 21.73,31.34 30.02,31.34 32.49,33.81 34.65,33.81 JP1.3
SCL
  Top 0.254: U4.28 15.22,11.32 16.71,9.83 53.32,9.83 56.68,13.18 57.33,13.18 | U2.18 70.51,11.71 69.04,13.18 57.33,13.18 | R1.2 57.33,13.18
SDA
  Top 0.254: U4.27 14.42,11.54 16.53,9.42 53.49,9.42 56.84,12.78 63.75,12.78 | U2.19 69.85,11.79 68.86,12.78 63.75,12.78 | R2.2 63.74,12.76 63.75,12.78